# Altium project base.PrjPcb
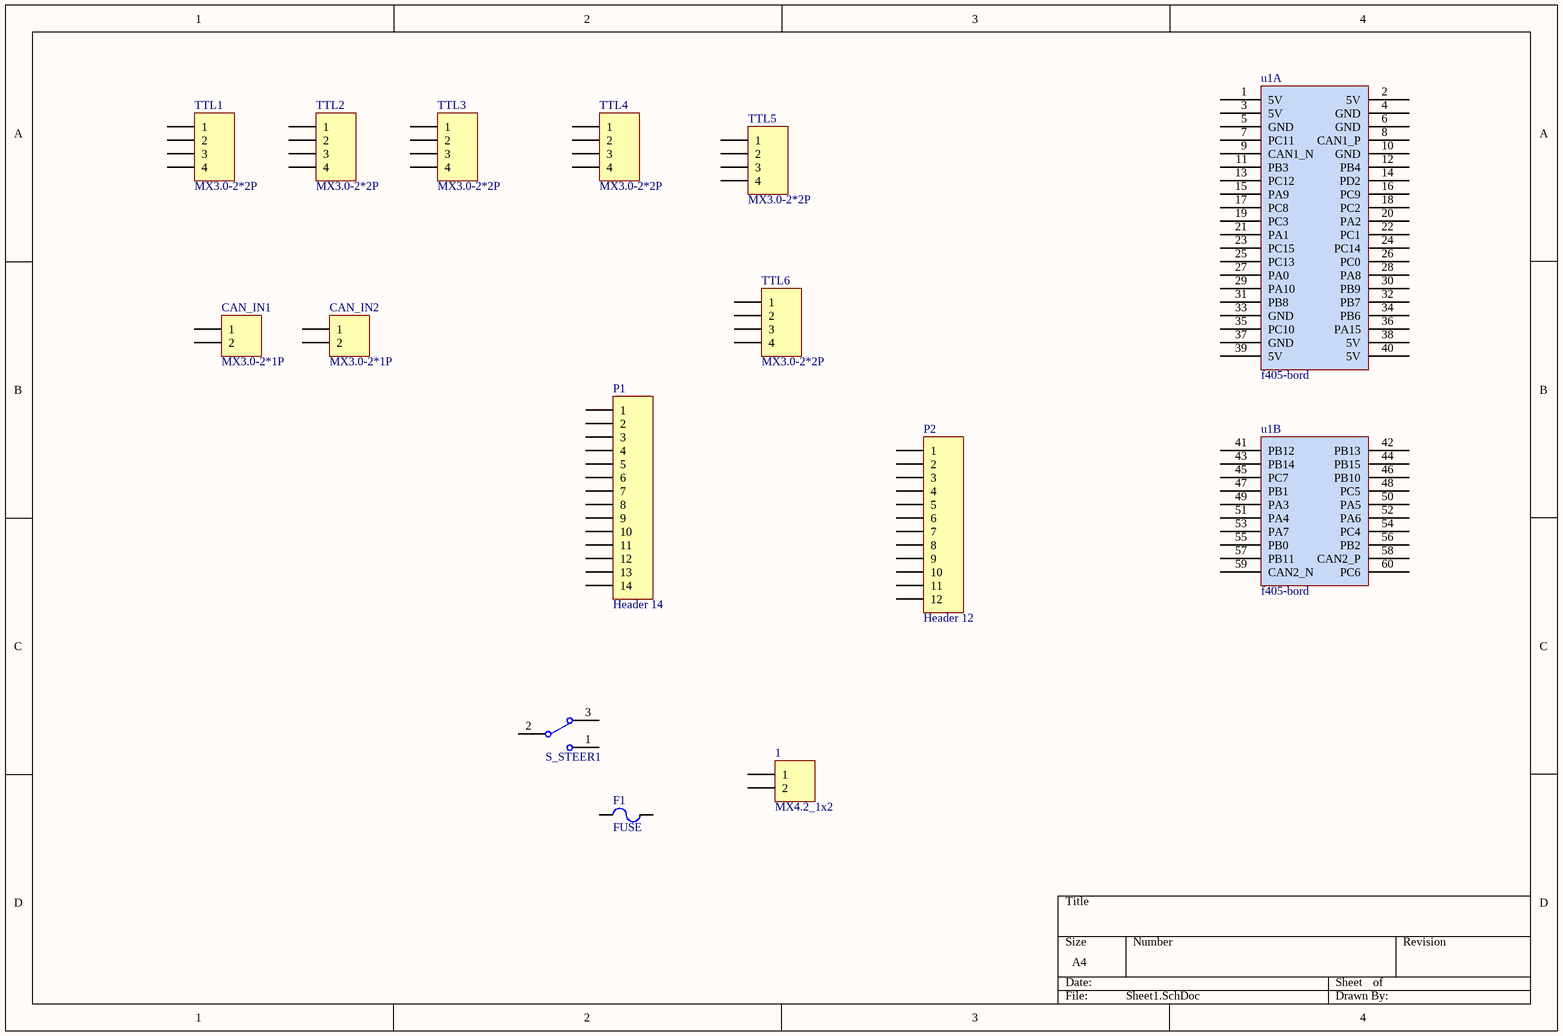
[diagram p0: Sheet1.SchDoc]
1 sheet, 14 parts. Net scope: global (net labels, ports and power ports of the same name join across sheets).
Board file: base.PcbDoc

## Sheet Sheet1.SchDoc
size A4; SheetNumber: 1; SheetTotal: 1

### Parts
1  MX4.2_1x2  [MX4.2_1x2]
CAN_IN1  MX3.0-2*1P  [MX3.0-2*1P]
CAN_IN2  MX3.0-2*1P  [MX3.0-2*1P]
F1  FUSE  [2512]
P1  Header 14  [HDR1X14]
P2  Header 12  [HDR1X12]
S_STEER1  Switch_li  [Switch_li]  (value not drawn)
TTL1  MX3.0-2*2P  [MX3.0-2*2P]
TTL2  MX3.0-2*2P  [MX3.0-2*2P]
TTL3  MX3.0-2*2P  [MX3.0-2*2P]
TTL4  MX3.0-2*2P  [MX3.0-2*2P]
TTL5  MX3.0-2*2P  [MX3.0-2*2P]
TTL6  MX3.0-2*2P  [MX3.0-2*2P]
u1  f405-bord  [f405-bord]  (parts A,B of 2)

### Nets

Not connected (* = marked no-connect by the designer): 1 1 2; CAN_IN1 1 2; CAN_IN2 1 2; F1 1 2; P1 1 2 3 4 5 6 7 8 9 10 11 12 13 14; P2 1 2 3 4 5 6 7 8 9 10 11 12; S_STEER1 1 2 3; TTL1 1 2 3 4; TTL2 1 2 3 4; TTL3 1 2 3 4; TTL4 1 2 3 4; TTL5 1 2 3 4; TTL6 1 2 3 4; u1 1(5V) 2(5V) 3(5V) 4(GND) 5(GND) 6(GND) 7(PC11) 8(CAN1_P) 9(CAN1_N) 10(GND) 11(PB3) 12(PB4) 13(PC12) 14(PD2) 15(PA9) 16(PC9) 17(PC8) 18(PC2) 19(PC3) 20(PA2) 21(PA1) 22(PC1) 23(PC15) 24(PC14) 25(PC13) 26(PC0) 27(PA0) 28(PA8) 29(PA10) 30(PB9) 31(PB8) 32(PB7) 33(GND) 34(PB6) 35(PC10) 36(PA15) 37(GND) 38(5V) 39(5V) 40(5V) 41(PB12) 42(PB13) 43(PB14) 44(PB15) 45(PC7) 46(PB10) 47(PB1) 48(PC5) 49(PA3) 50(PA5) 51(PA4) 52(PA6) 53(PA7) 54(PC4) 55(PB0) 56(PB2) 57(PB11) 58(CAN2_P) 59(CAN2_N) 60(PC6)

### Library data of the parts
P1 = Header 14: Header, 14-Pin; LatestRevisionDate: 17-Jul-2002; LatestRevisionNote: Re-released for DXP Platform.; Publisher: Altium Limited
P2 = Header 12: Header, 12-Pin; LatestRevisionDate: 17-Jul-2002; LatestRevisionNote: Re-released for DXP Platform.; Publisher: Altium Limited